# Altium schematic sheet 遙控繼電器.SchDoc
size A3
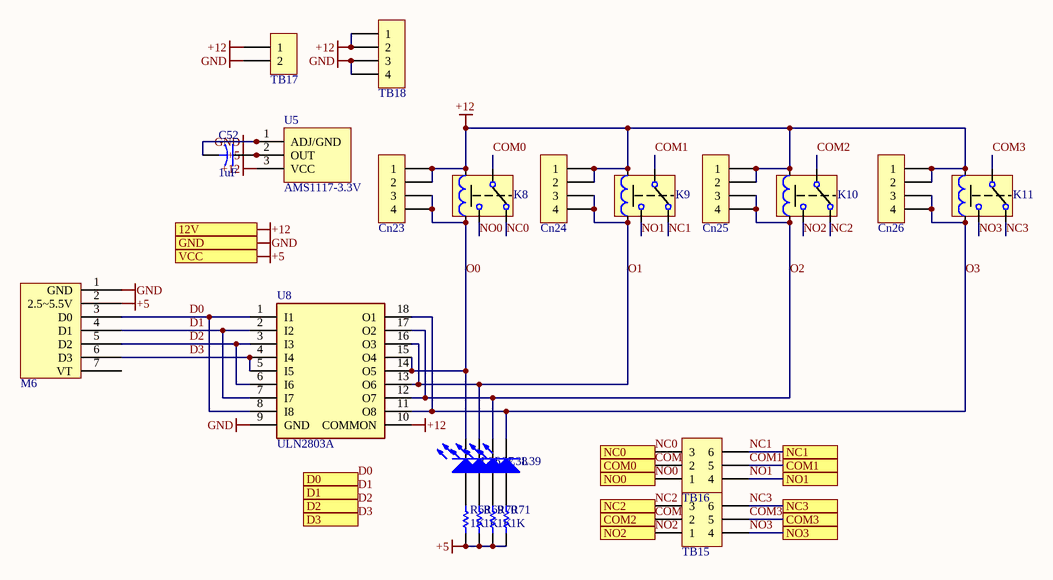
[diagram p0: 遙控繼電器.SchDoc]

## Parts
C52  1uF  [CAP-1210]
Cn23  KF2510-4  [Connector_KF2510-4A]  (value not drawn)
Cn24  KF2510-4  [Connector_KF2510-4A]  (value not drawn)
Cn25  KF2510-4  [Connector_KF2510-4A]  (value not drawn)
Cn26  KF2510-4  [Connector_KF2510-4A]  (value not drawn)
K8  G2R-1-24VDC  [RELAY-HF41F-012-ZST]  (value not drawn)
K9  G2R-1-24VDC  [RELAY-HF41F-012-ZST]  (value not drawn)
K10  G2R-1-24VDC  [RELAY-HF41F-012-ZST]  (value not drawn)
K11  G2R-1-24VDC  [RELAY-HF41F-012-ZST]  (value not drawn)
L36  藍  [LED-1206]  (value not drawn)
L37  藍  [LED-1206]  (value not drawn)
L38  藍  [LED-1206]  (value not drawn)
L39  藍  [LED-1206]  (value not drawn)
M6  XR390  [XR390 Module]  (value not drawn)
R68  1K  [Res-1206]
R69  1K  [Res-1206]
R70  1K  [Res-1206]
R71  1K  [Res-1206]
TB15  KF2EDGRT-5.08_6P  [Terminal block(KF2EDGRT-3.81_2*3P)]  (value not drawn)
TB16  KF2EDGRT-5.08_6P  [Terminal block(KF2EDGRT-3.81_2*3P)]  (value not drawn)
TB17  ZB25(2P)  [Terminal block(KF2EDGR-5.08 _2P)]  (value not drawn)
TB18  KF2EDGRT-5.08_4P  [Terminal block(KF2EDGR-5.08 _4P)]  (value not drawn)
U5  AMS1117-3.3V  [SOT 223]
U8  ULN2803A  [DIP-18]

## Ports
12V, COM0, COM1, COM2, COM3, D0, D1, D2, D3, GND, NC0, NC1, NC2, NC3, NO0, NO1, NO2, NO3, VCC

## Nets
+5: C52.1 M6.2(2.5~5.5V) R68.2 R69.2 R70.2 R71.2 U5.2(OUT) ; port VCC
+12: Cn23.1 Cn23.2 Cn24.1 Cn24.2 Cn25.1 Cn25.2 Cn26.1 Cn26.2 K8.4(A1) K9.4(A1) K10.4(A1) K11.4(A1) TB17.1 TB18.1 TB18.2 U5.3(VCC) U8.10(COMMON) ; port 12V
GND: C52.2 M6.1(GND) TB17.2 TB18.3 TB18.4 U5.1(ADJ/GND) U8.9(GND) ; port GND
COM0: K8.1(COM) TB16.2 ; port COM0
COM1: K9.1(COM) TB16.5 ; port COM1
COM2: K10.1(COM) TB15.2 ; port COM2
COM3: K11.1(COM) TB15.5 ; port COM3
D0: M6.3(D0) U8.1(I1) U8.8(I8) ; port D0
D1: M6.4(D1) U8.2(I2) U8.7(I7) ; port D1
D2: M6.5(D2) U8.3(I3) U8.6(I6) ; port D2
D3: M6.6(D3) U8.4(I4) U8.5(I5) ; port D3
NC0: K8.3(NC) TB16.3 ; port NC0
NC1: K9.3(NC) TB16.6 ; port NC1
NC2: K10.3(NC) TB15.3 ; port NC2
NC3: K11.3(NC) TB15.6 ; port NC3
NO0: K8.2(NO) TB16.1 ; port NO0
NO1: K9.2(NO) TB16.4 ; port NO1
NO2: K10.2(NO) TB15.1 ; port NO2
NO3: K11.2(NO) TB15.4 ; port NO3
O0: Cn23.3 Cn23.4 K8.5(A2) L36.1(K) U8.14(O5) U8.15(O4)
O1: Cn24.3 Cn24.4 K9.5(A2) L37.1(K) U8.13(O6) U8.16(O3)
O2: Cn25.3 Cn25.4 K10.5(A2) L38.1(K) U8.12(O7) U8.17(O2)
O3: Cn26.3 Cn26.4 K11.5(A2) L39.1(K) U8.11(O8) U8.18(O1)
NetL36_2: L36.2(A) R68.1
NetL37_2: L37.2(A) R69.1
NetL38_2: L38.2(A) R70.1
NetL39_2: L39.2(A) R71.1

Not connected (* = marked no-connect by the designer): M6 7(VT)

## Library data of the parts
C52 = Cap: 電容; ComponentLink1Description: datasheet; ComponentLink1URL: https://product.tdk.com/system/files/dam/doc/product/capacitor/ceramic/mlcc/catalog/mlcc_commercial_general_en.pdf
Cn23-Cn26 = Contact(4P): 接線端子
K8-K11 = Relay: 繼電器
L36-L39 = LED
M6 = XR390: 遙控器模組
R68-R71 = Res: 電阻
TB15 TB16 = Terminal block(6P): 端子台
TB17 = Terminal block(2P): 端子台
TB18 = Terminal block(4P): 端子台
U5 = AMS1117: 降壓IC,LOD
U8 = TBD62083A: 閘極驅動器 P型 50V 0.5A; Manufacturer_Name: Toshiba; Manufacturer_Part_Number: TBD62083AFNG,EL; Geometry.Height: 1.55mm; Mouser Part Number: 757-TBD60183AFNGEL; Mouser Price/Stock: https://www.mouser.co.uk/ProductDetail/Toshiba/TBD62183AFNGEL?qs=lYGu3FyN48dJ%2FQ%2FqZoTqjQ%3D%3D; Datasheet Link: chrome-extension://efaidnbmnnnibpcajpcglclefindmkaj/https://www.mouser.tw/datasheet/2/408/TBD62083AFWG_datasheet_en_20160511-769679.pdf; ComponentLink1Description: datasheet; ComponentLink1URL: https://www.mouser.tw/datasheet/2/408/TBD62083AFNG_datasheet_en_20160511-769697.pdf